# EAGLE design multi_sensor (EAGLE 6.5.0)
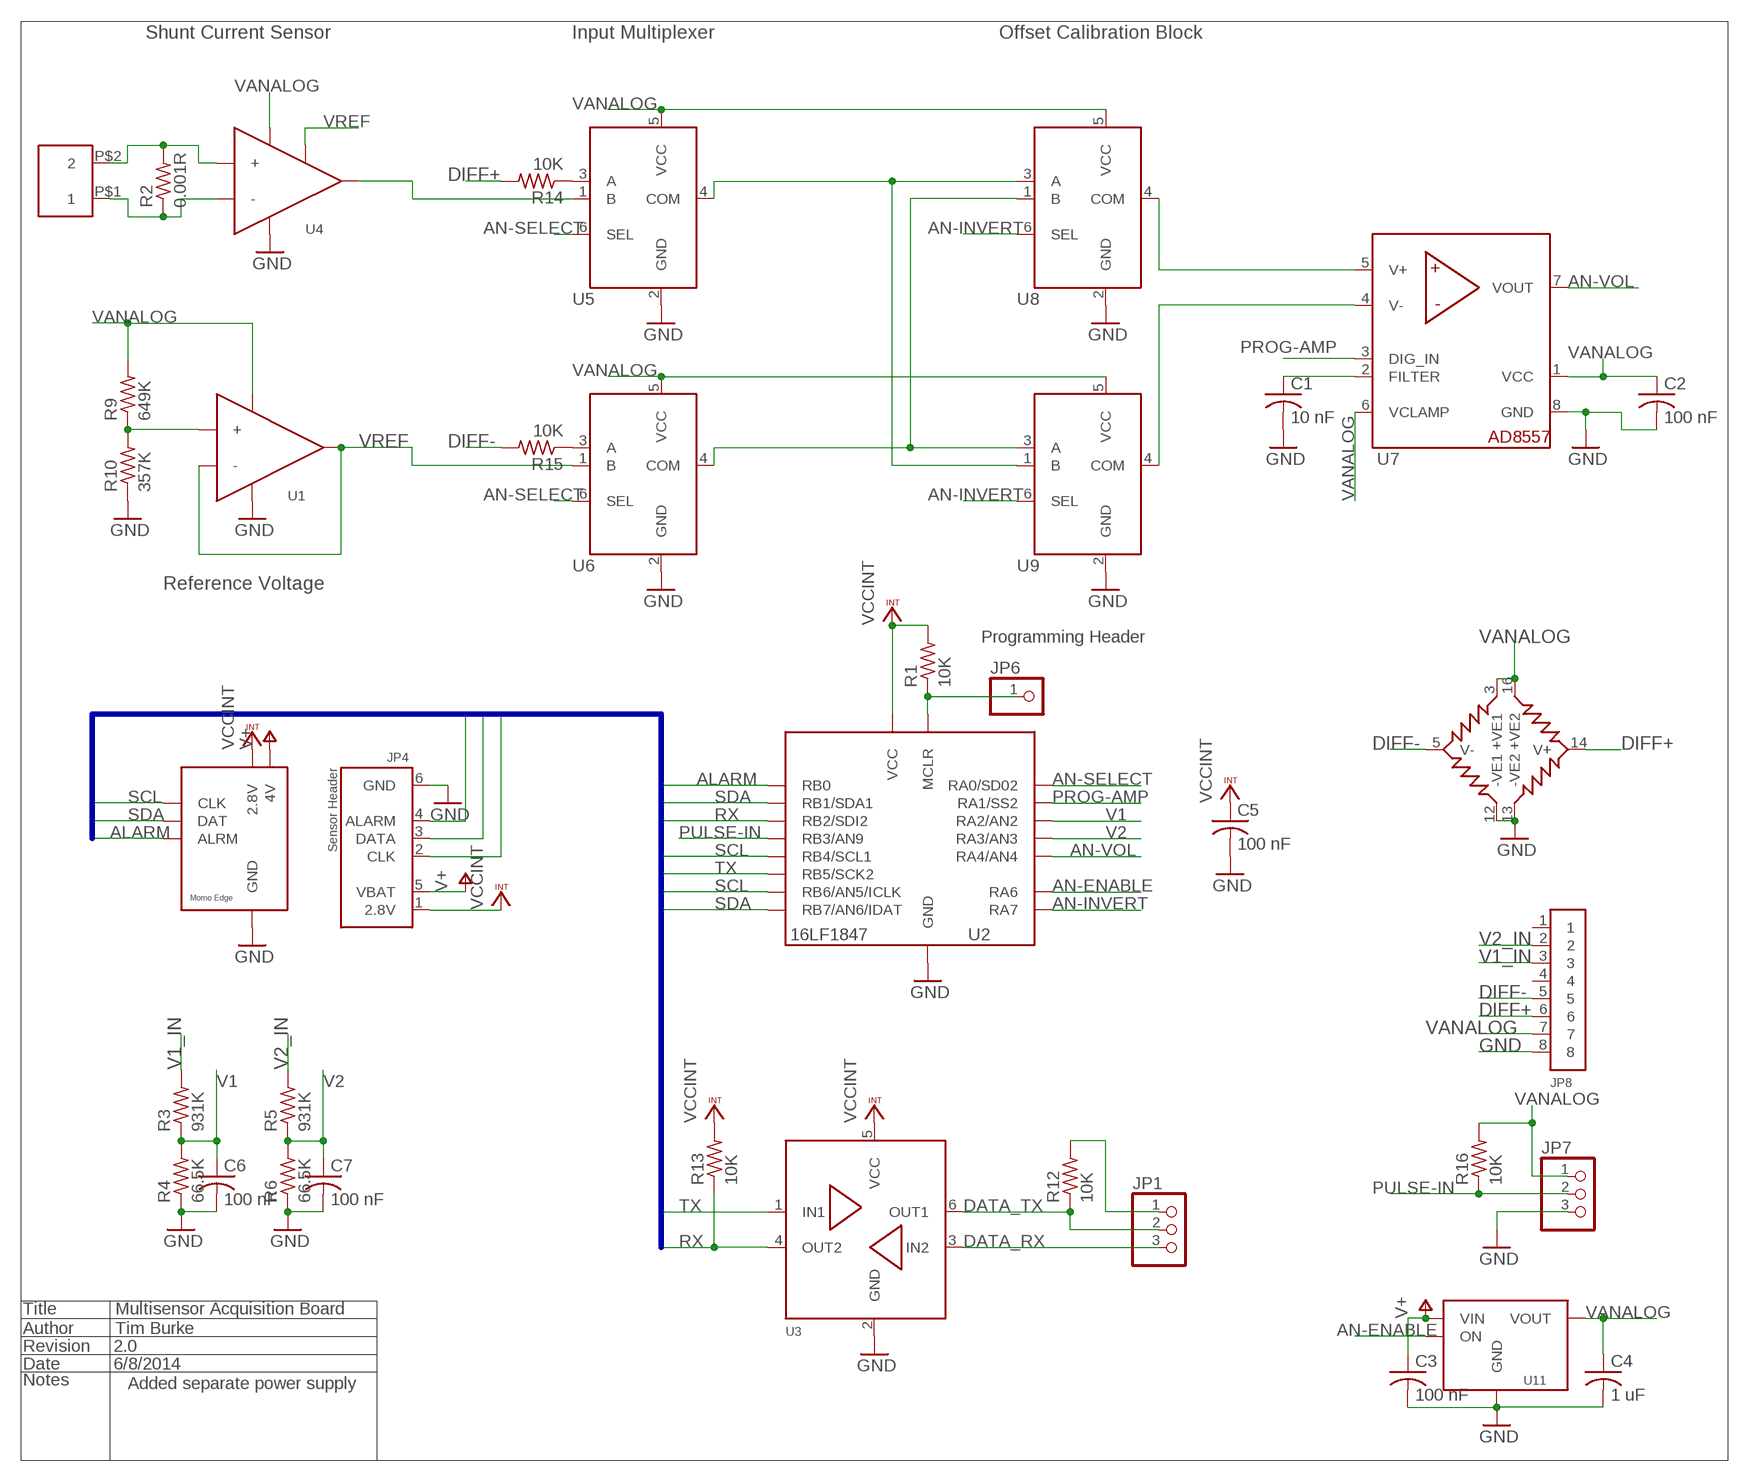
[diagram p0: schematic, sheet 1]

## Parts
C1  10 nF  C-USC0402  [C0402]
C2  100 nF  C-USC0402K  [C0402K]
C3  100 nF  C-USC0402K  [C0402K]
C4  1 uF  C-USC0402K  [C0402K]
C5  100 nF  C-USC0402K  [C0402K]
C6  100 nF  C-USC0402K  [C0402K]
C7  100 nF  C-USC0402K  [C0402K]
JP1  PINHD-1X3  [1X03]
JP2  MOMO-VERT-6M  [1X06]
JP3  5MM-SCREWTERM-2POS  [5MM-SCREWTERM]
JP4  MOMO-SENSOR-RJ11  [RJ-12]
JP6  PINHD-1X1  [1X01]
JP7  PINHD-1X3  [1X03]
JP8  8PIN-TERMBLOCK-PUSH  [8-PIN-TERMBLOCK-PUSH]
R1  10K  R-US_R0603  [R0603]
R2  0.001R  R-US_R2512  [R2512]
R3  931K  R-US_R0603  [R0603]
R4  66.5K  R-US_R0603  [R0603]
R5  931K  R-US_R0603  [R0603]
R6  66.5K  R-US_R0603  [R0603]
R9  649K  R-US_R0603  [R0603]
R10  357K  R-US_R0603  [R0603]
R12  10K  R-US_R0603  [R0603]
R13  10K  R-US_R0603  [R0603]
R14  10K  R-US_R0603  [R0603]
R15  10K  R-US_R0603  [R0603]
R16  10K  R-US_R0603  [R0603]
U1  MCP6001U  [SOT23-5L]
U2  16LF1847  [SSOP20]
U3  DUAL-BUFFER-OD-NC7WZ07  [SC70-6L]
U4  LT1990  [SOP08]
U5  2:1-MUX  [SOT363_INFINEON]
U6  2:1-MUX  [SOT363_INFINEON]
U7  AD8557-DIGITRIM-OPAMP  [SOIC8]
U8  2:1-MUX  [SOT363_INFINEON]
U9  2:1-MUX  [SOT363_INFINEON]
U10  SM5470-DIFF-PRESS-SENSOR  [SO16W]
U11  TCR2EF28-LINREG  [SC74A-5PIN]

## Nets
ALARM: JP2.5(ALRM) JP4.4(ALARM) U2.7(RB0)
AN-ENABLE: U2.17(RA6) U11.3(ON)
AN-INVERT: U2.18(RA7) U8.6(SEL) U9.6(SEL)
AN-SELECT: U2.19(RA0/SD02) U5.6(SEL) U6.6(SEL)
AN-VOL: U2.3(RA4/AN4) U7.7(VOUT)
DATA_RX: JP1.3 U3.3(IN2)
DATA_TX: JP1.2 R12.1 U3.6(OUT1)
DIFF+: JP8.6 R14.2 U10.14(V+)
DIFF-: JP8.5 R15.2 U10.5(V-)
GND: C1.2 C2.2 C3.2 C4.2 C5.2 C6.2 C7.2 JP2.7(GND) JP4.6(GND) JP7.3 JP8.8 R4.1 R6.1 R10.1 U1.2(GND) U2.5(GND) U2.6(GND) U3.2(GND) U4.4(GND) U5.2(GND) U6.2(GND) U7.8(GND) U8.2(GND) U9.2(GND) U10.12(-VE1) U10.13(-VE2) U11.2(GND)
N$2: JP1.1 R12.2
N$3: R9.1 R10.2 U1.1(+)
N$4: JP6.1 R1.1 U2.4(MCLR)
N$5: U5.4(COM) U8.3(A) U9.1(B)
N$6: R14.1 U5.3(A)
N$7: C1.1 U7.2(FILTER)
N$8: U6.4(COM) U8.1(B) U9.3(A)
N$9: R15.1 U6.3(A)
N$13: U7.5(V+) U8.4(COM)
N$14: U7.4(V-) U9.4(COM)
N$16: U4.6(OUT) U5.1(B)
PROG-AMP: U2.20(RA1/SS2) U7.3(DIG_IN)
PULSE-IN: JP7.2 R16.1 U2.10(RB3/AN9)
RS+: JP3.P$1 R2.1 U4.2(-)
RS-: JP3.P$2 R2.2 U4.3(+)
RX: R13.1 U2.9(RB2/SDI2) U3.4(OUT2)
SCL: JP2.3(CLK) JP4.2(CLK) U2.11(RB4/SCL1) U2.13(RB6/AN5/ICLK)
SDA: JP2.4(DAT) JP4.3(DATA) U2.8(RB1/SDA1) U2.14(RB7/AN6/IDAT)
TX: U2.12(RB5/SCK2) U3.1(IN1)
V1: C6.1 R3.1 R4.2 U2.1(RA2/AN2)
V1_IN: JP8.3 R3.2
V2: C7.1 R5.1 R6.2 U2.2(RA3/AN3)
V2_IN: JP8.2 R5.2
V+: C3.1 JP2.6(4V) JP4.5(VBAT) U11.1(VIN)
VANALOG: C2.1 C4.1 JP7.1 JP8.7 R9.2 R16.2 U1.5(VCC) U4.7(VCC) U5.5(VCC) U6.5(VCC) U7.1(VCC) U7.6(VCLAMP) U8.5(VCC) U9.5(VCC) U10.3(+VE1) U10.16(+VE2) U11.5(VOUT)
VCCINT: C5.1 JP2.1(2.8V) JP4.1(2.8V) R1.2 R13.2 U2.15(VCC) U2.16(VCC) U3.5(VCC)
VREF: U1.3(-) U1.4(OUT) U4.1(SHUT) U6.1(B)
Unconnected: JP8.1 JP8.4

## Buses
MIB:SDA,SCL,ALARM,TX,RX

## Notes on the sheet
- Shunt Current Sensor | Input Multiplexer | Offset Calibration Block
- Reference Voltage
- Programming Header
- Title | Multisensor Acquisition Board
- Author | Tim Burke
- Revision | 2.0
- Date | 6/8/2014
- Notes | Added separate power supply

## Library data of the parts
C1 = rcl:C-US: CAPACITOR, American symbol; DIGIKEY-PN: 490-6286-1-ND
C2 C3 C5-C7 = rcl:C-US: CAPACITOR, American symbol; DIGIKEY-PN: 445-1265-1-ND
C4 = rcl:C-US: CAPACITOR, American symbol; DIGIKEY-PN: 445-4114-1-ND
JP1 JP7 = pinhead:PINHD-1X3: PIN HEADER
JP2 = components:MOMO-VERT-6M; DIGIKEY-PN: S7004-ND
JP3 = components:5MM-SCREWTERM-2POS; DESCRIPTION: 2 position screw terminal; DIGIKEY-PN: 277-1667-ND; FOOTPRINT: Through Hole
JP4 = components:MOMO-SENSOR-RJ11; DIGIKEY-PN: AE10371-ND
JP6 = pinhead:PINHD-1X1: PIN HEADER
JP8 = components:8PIN-TERMBLOCK-PUSH; DESCRIPTION: 8-pin terminal block with push connectors; DIGIKEY-PN: 277-1628-ND; FOOTPRINT: Through Hole
R1 R12-R16 = rcl:R-US_: RESISTOR, American symbol; DIGIKEY-PN: P10.0KHCT-ND
R2 = rcl:R-US_: RESISTOR, American symbol; DIGIKEY-PN: CRF2512-FV-R001ELFCT-ND
R3 R5 = rcl:R-US_: RESISTOR, American symbol; DIGIKEY-PN: RHM931KCLCT-ND
R4 R6 = rcl:R-US_: RESISTOR, American symbol; DIGIKEY-PN: RC0603FR-0766K5L
R9 = rcl:R-US_: RESISTOR, American symbol; DIGIKEY-PN: 311-649KHRCT-ND
R10 = rcl:R-US_: RESISTOR, American symbol; DIGIKEY-PN: RC0603FR-07357KL
U1 = components:MCP6001U: MCP6001 General purpose op-amp in SOT23-5 package with U pin assignment; DESCRIPTION: MCP6001 General Purpose Op-Amp; DIGIKEY-PN: MCP6001UT-I/OTCT-ND; FOOTPRINT: SOT23-5
U2 = components:16LF1847; DIGIKEY-PN: PIC16LF1847-I/SS-ND
U3 = components:DUAL-BUFFER-OD-NC7WZ07: NC7WZ07 Dual Buffer with OD outputs and 5V tolerant inputs; DESCRIPTION: Dual open drain buffers; DIGIKEY-PN: NC7WZ07P6XCT-ND; FOOTPRINT: SO70-6
U4 = components:LT1990; DESCRIPTION: LT1990 High CM op amp; DIGIKEY-PN: LT1990CS8#PBF-ND; FOOTPRINT: SO-8
U5 U6 U8 U9 = components:2:1-MUX: 2:1 Analog Multiplexer -- low selects A, high B; DESCRIPTION: 2:1 Analog multiplexer; DIGIKEY-PN: 568-7765-1-ND; FOOTPRINT: SOT-363
U7 = components:AD8557-DIGITRIM-OPAMP: AD8557 Digitally controlled operational amplifier; DESCRIPTION: AD8557 Digitally controlled op-amp; DIGIKEY-PN: AD8557ARZ-ND; FOOTPRINT: SOIC-8
U10 = components:SM5470-DIFF-PRESS-SENSOR; DESCRIPTION: SM5470 Differential pressure sensor; FOOTPRINT: SO16-Wide; MANU: SI-Micro; MPN: SM5470; POPULATE: no
U11 = components:TCR2EF28-LINREG; DESCRIPTION: TCR2EF 2.8V Linear Regulator; DIGIKEY-PN: TCR2EF28LMCT-ND; FOOTPRINT: SC74A

## Board
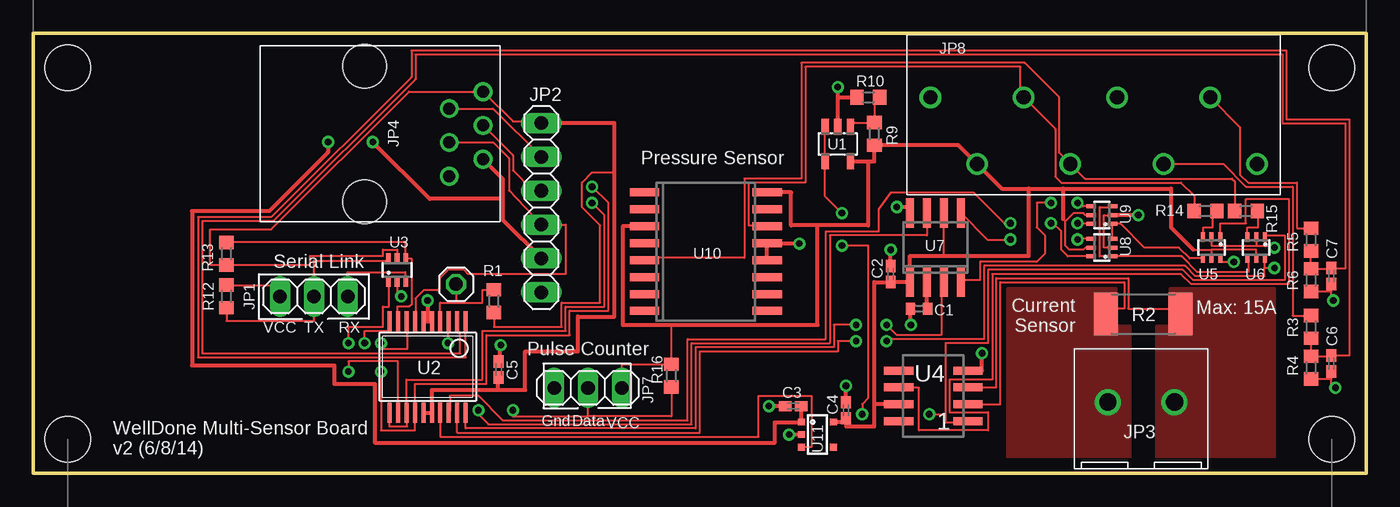
[diagram p1: board, top side]
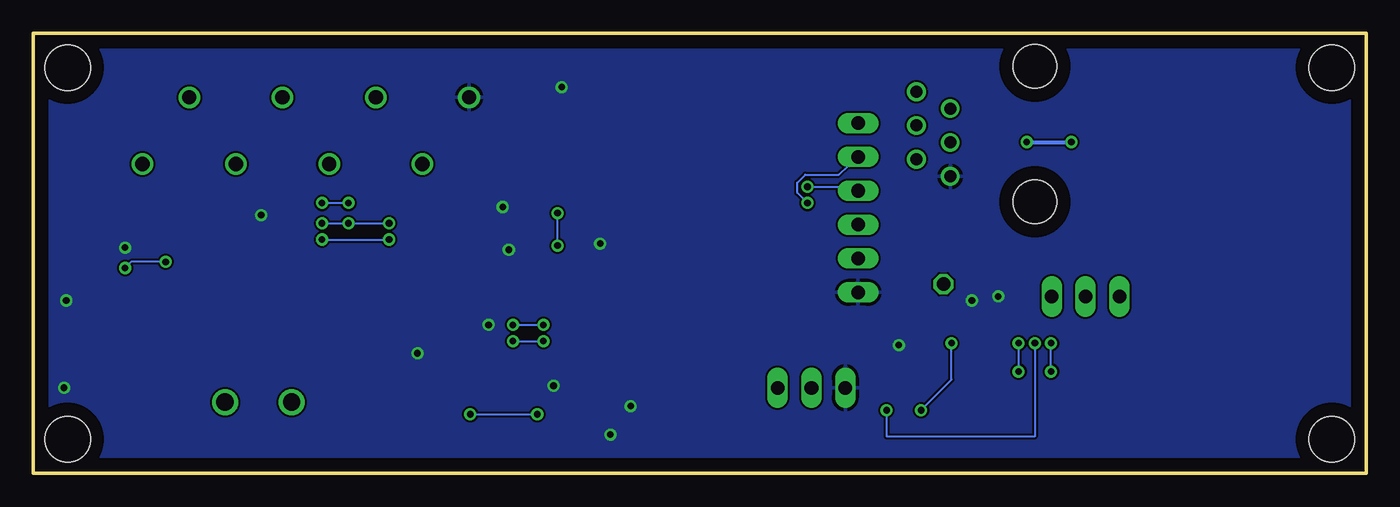
[diagram p2: board, bottom side, seen from below]

Size 100.03 x 33.02 mm. Coordinates in mm from the lower left corner, seen from the top.
Outline: 0,33.02 0,0 100.03,0 100.03,33.02 0,33.02
Copper layers (1*16): Top 0.035mm / dielectric 1.5mm / Bottom 0.035mm
Design rules "default *": minimum track width 6mil, minimum drill 19mil, track to track 6mil, track to pad 6mil, pad to pad 8mil, via to via 8mil, smd to smd 8mil, copper to edge 40mil, drill to drill 8mil, minimum pad ring 10mil, minimum via ring 8mil, stop-mask expansion 4mil, vias tented up to drill 0mil, thermal gap 10mil
Holes 3.43 mm at 2.57,2.57 2.57,30.45 97.46,30.45 97.46,2.57

### Footprints (pad centres in the part's own frame; a part is rotated, then mirrored left to right if it is on the bottom)
C0402 = smd 0.7 x 0.9: 1 -0.65,0; 2 0.65,0
C0402K = smd 0.925 x 0.74: 1 -0.6,0; 2 0.6,0
1X03 = drill 1.016 long: 1 -2.54,0; 2 0,0; 3 2.54,0
1X06 = drill 1.016 long: 1 -8.89,0; 3 -6.35,0; 4 -3.81,0; 5 -1.27,0; 6 1.27,0; 7 3.81,0
5MM-SCREWTERM = drill 1.3: P$1 -3,0; P$2 2,0
RJ-12 = drill 0.9: 1 -3.17,8.89; 2 -1.9,6.35; 3 -0.63,8.89; 4 0.64,6.35; 5 1.91,8.89; 6 3.18,6.35 | hole 3.28: -5.08,0; 5.08,0
1X01 = drill 1.016 octagon: 1 0,0
8-PIN-TERMBLOCK-PUSH = drill 1.076: 1 -15.75,5; 2 -12.25,0; 3 -8.75,5; 4 -5.25,0; 5 -1.75,5; 6 1.75,0; 7 5.25,5; 8 8.75,0
R0603 = smd 1 x 1.1: 1 -0.85,0; 2 0.85,0
R2512 = smd 1.8 x 3.2: 1 -2.8,0; 2 2.8,0
SOT23-5L = smd 0.55 x 1.2: 1 -0.95,-1.3; 2 0,-1.3; 3 0.95,-1.3; 4 0.95,1.3; 5 -0.95,1.3
SSOP20 = smd 0.3 x 1.5: 1 -2.857,-3.431; 2 -2.222,-3.431; 3 -1.587,-3.431; 4 -0.952,-3.431; 5 -0.317,-3.431; 6 0.318,-3.431; 7 0.953,-3.431; 8 1.588,-3.431; 9 2.223,-3.431; 10 2.858,-3.431; 11 2.858,3.431; 12 2.219,3.431; 13 1.588,3.431; 14 0.953,3.431; 15 0.318,3.431; 16 -0.317,3.431; 17 -0.952,3.431; 18 -1.587,3.431; 19 -2.222,3.431; 20 -2.857,3.431
SC70-6L = smd 0.35 x 0.8: 1 -0.65,-0.85; 2 0,-0.85; 3 0.65,-0.85; 4 0.65,0.85; 5 0,0.85; 6 -0.65,0.85
SOP08 = smd 0.6 x 2.2: 1 -1.905,-2.6; 2 -0.635,-2.6; 3 0.635,-2.6; 4 1.905,-2.6; 5 1.905,2.6; 6 0.635,2.6; 7 -0.635,2.6; 8 -1.905,2.6
SOT363_INFINEON = smd 0.3 x 0.7: 1 -0.65,-0.8; 2 0,-0.8; 3 0.65,-0.8; 4 0.65,0.8; 5 0,0.8; 6 -0.65,0.8
SOIC8 = smd 0.6 x 2.2: 1 -1.905,-2.6; 2 -0.635,-2.6; 3 0.635,-2.6; 4 1.905,-2.6; 5 1.905,2.6; 6 0.635,2.6; 7 -0.635,2.6; 8 -1.905,2.6
SO16W = smd 0.6 x 2.2: 1 -4.445,-4.6; 2 -3.175,-4.6; 3 -1.905,-4.6; 4 -0.635,-4.6; 5 0.635,-4.6; 6 1.905,-4.6; 7 3.175,-4.6; 8 4.445,-4.6; 9 4.445,4.6; 10 3.175,4.6; 11 1.905,4.6; 12 0.635,4.6; 13 -0.635,4.6; 14 -1.905,4.6; 15 -3.175,4.6; 16 -4.445,4.6
SC74A-5PIN = smd 0.5 x 0.5: 1 -0.95,-1.2; 2 0,-1.2; 3 0.95,-1.2; 4 0.95,1.2; 5 -0.95,1.2

### Placement (x,y rotation side)
C1  66.47,12.37 180 top
C2  64.34,14.96 90 top
C3  57.02,5.05 180 top
C4  60.99,4.75 90 top
C5  34.93,7.8 90 top
C6  97.41,8.25 270 top
C7  97.41,14.81 270 top
JP1  21.06,13.28 0 top
JP2  38.13,17.4 270 top
JP3  83.64,5.36 0 top
JP4  24.87,25.48 270 top
JP6  31.72,14.2 0 top
JP7  41.63,6.43 180 top
JP8  76.07,28.22 180 top
R1  34.57,12.93 270 top
R2  83.29,11.96 0 top
R3  95.89,11 90 top
R4  95.89,7.95 90 top
R5  95.89,17.55 90 top
R6  95.89,14.5 90 top
R9  63.12,25.48 270 top
R10  62.66,28.22 0 top
R12  14.5,13.28 90 top
R13  14.5,16.48 270 top
R14  87.96,19.68 180 top
R15  91.01,19.68 180 top
R16  47.88,7.34 90 top
U1  60.38,24.71 180 top
U2  29.59,8 180 top
U3  27.3,15.27 0 top
U4  67.54,5.82 90 top
U5  88.42,16.94 180 top
U6  91.77,16.94 180 top
U7  67.69,16.94 0 top
U8  80.19,16.94 90 top
U9  80.19,19.38 90 top
U10  50.47,16.64 270 top
U11  58.85,2.92 270 top

### Tracks (layer width: path | path; a pad name or v marks a point on that pad's centre or on a via)
ALARM
  Top 0.152: JP4.4 34.5,24.84 35.69,23.65 35.69,21.23 JP2.5 39.95,18.67 39.95,14.96 32.64,14.96 32.33,15.27 31.12,15.27 30.51,14.66 30.51,13.89 30.35,13.74 29.29,13.74 28.68,13.13 28.68,11.47 U2.7
AN-ENABLE
  Top 0.152: U2.17 30.54,2.77 54.43,2.77 54.43,5.82 58.39,5.82 58.39,1.97 U11.3
AN-INVERT  (via drill 0.5)
  Top 0.152: U8.6 77.64,16.29 77.14,16.79 77.14,18.16 76.53,18.77 v76.38,18.77 | U9.6 78.4,18.73 v78.36,18.77 | v73.33,18.77 72.87,18.77 70.59,21.06 64.34,21.06 63.42,19.84 63.42,18.16 59.46,18.16 59.46,10.08 49.1,10.08 49.1,3.99 35.23,3.99 33.4,5.82 31.27,5.82 31.27,4.66 U2.18
  Bottom 0.152: v78.36,18.77 v76.38,18.77 v73.33,18.77
AN-SELECT  (via drill 0.5)
  Top 0.152: U6.6 92.38,16.14 92.38,15.42 | 89.07,15.88 U5.6 89.03,16.14 89.03,15.88 89.07,15.88 | 92.38,15.42 92.38,14.81 87.2,14.81 86.44,15.57 71.35,15.57 71.35,10.08 64.19,10.08 v64.03,9.93 | 92.38,15.42 v93.14,15.42 | 89.07,15.88 v90.09,15.88 | v61.75,9.93 60.38,9.93 60.38,9.17 50.01,9.17 50.01,3.07 31.81,3.07 U2.19
  Bottom 0.152: v90.09,15.88 92.68,15.88 v93.14,15.42 | v64.03,9.93 v61.75,9.93
AN-VOL  (via drill 0.5)
  Top 0.152: U7.7 67.06,17.86 59.77,17.86 59.77,9.78 49.4,9.78 49.4,3.68 34.16,3.68 33.4,4.45 v33.4,4.75 | v31.12,9.78 31.12,11.43 U2.3
  Bottom 0.152: v33.4,4.75 31.12,7.04 v31.12,9.78
DATA_RX
  Top 0.152: JP1.3 23.6,15.11 27.91,15.11 27.91,14.26 U3.3
DATA_TX
  Top 0.152: R12.1 14.5,11.46 21.06,11.46 JP1.2 21.06,15.96 26.5,15.96 U3.6
DIFF+
  Top 0.152: R14.2 87.11,20.84 86.13,21.82 77.14,21.82 76.68,22.28 76.68,25.86 JP8.6 74.09,28.45 74.09,30.51 57.94,30.51 57.94,21.82 53.67,21.82 53.67,18.62 55.07,18.62 U10.14
DIFF-
  Top 0.152: R15.2 90.16,21.91 89.94,22.12 78.92,22.12 JP8.5 76.99,24.06 76.99,28.22 74.4,30.81 57.63,30.81 57.63,22.12 53.37,22.12 53.37,16.18 45.87,16.18 U10.5
GND  (via drill 0.5)
  Top 0.152: v97.71,6.43 97.41,6.43 97.41,7.1 | 97.41,7.1 C6.2 | v97.56,12.98 97.41,12.98 97.41,13.65 | 97.41,13.65 C7.2 | R6.1 97.41,13.65 | R4.1 97.41,7.1 | U5.2 88.42,17.09 91.77,17.09 | U6.2 91.77,17.09 | 91.77,17.09 92.68,17.09 v93.14,16.94 | U8.2 80.34,16.94 80.34,19.38 U9.2 | U3.2 27.31,13.44 v27.61,13.28
  Top 0.305: U4.4 71.2,7.72 v71.2,9.02 | v82.93,19.38 U9.2 | U1.2 60.38,28.22 | 60.38,28.22 R10.1 | U7.8 65.79,19.99 v64.8,19.99 | C2.2 v64.34,16.79 | v65.86,11.15 65.82,11.15 C1.2 | 60.38,28.22 v60.38,28.98 | U10.12 U10.13 55.07,17.25 v57.48,17.25 | C5.2 35.03,8.41 35.03,9.63 v35.08,9.63 | U2.6 U2.5 29.59,11.43 v29.59,12.98 | C3.2 v55.19,5.05 | U11.2 v56.72,2.92 | C4.2 v60.99,6.58
  pour Bottom: -0.58,33.55 -0.58,-0.74 101.22,-0.74 101.22,33.55
N$2
  Top 0.152: R12.2 18.52,14.13 JP1.1
N$3
  Top 0.152: U1.1 61.64,26.33 R9.1 63.12,27.76 63.42,28.07 63.42,28.13 R10.2
N$4
  Top 0.152: U2.4 30.54,12.83 31.72,12.83 | 31.72,12.83 33.71,12.83 33.71,13.78 R1.1 | JP6.1 31.72,12.83
N$5
  Top 0.152: U5.4 86.78,16.14 85.98,16.94 83.39,16.94 81.6,18.73 U9.1 U8.3
N$6
  Top 0.152: U5.3 87.81,17.74 87.81,18.47 88.51,18.47 88.51,19.69 R14.1
N$7
  Top 0.152: 67.08,14.34 U7.2
  Top 0.305: C1.1 67.06,12.37 U7.2
N$8
  Top 0.152: U6.4 91.16,16.14 91.16,15.11 87.35,15.11 86.17,16.29 U8.1 80.04,16.29 80.04,19.99 80.99,19.99 U9.3
N$9
  Top 0.152: U6.3 91.12,18.47 91.92,18.47 91.92,19.69 R15.1
N$13  (via drill 0.5)
  Top 0.152: U8.4 78.4,17.59 v78.36,17.55 | U7.5 71.59,17.55 v73.33,17.55
  Bottom 0.152: v78.36,17.55 v73.33,17.55
N$14  (via drill 0.5)
  Top 0.152: U9.4 78.78,20.03 v78.36,20.29 | v76.38,20.29 75.31,20.29 75.31,18.47 75.92,17.86 75.92,16.48 75.31,15.88 71.04,15.88 71.04,14.5 69.6,14.5 U7.4
  Bottom 0.152: v78.36,20.29 v76.38,20.29
N$16
  Top 0.152: U5.1 89.07,18.77 91.01,18.77 91.01,20.6 94.21,20.6 94.21,14.2 86.89,14.2 86.13,14.96 71.96,14.96 71.96,7.04 68.76,7.04 68.76,4.6 71.65,4.6 71.65,3.23 66.47,3.23 66.47,6.43 64.94,6.43 U4.6
PROG-AMP  (via drill 0.5)
  Top 0.152: U7.3 68.15,14.34 68.15,10.39 64.8,10.39 v64.03,11.15 | v61.75,11.15 60.07,11.15 60.07,9.47 49.71,9.47 49.71,3.38 32.45,3.38 U2.20
  Bottom 0.152: v64.03,11.15 v61.75,11.15
PULSE-IN  (via drill 0.5)
  Top 0.152: v35.99,4.75 35.99,4.29 41.63,4.29 | 41.63,4.29 JP7.2 | R16.1 47.88,4.29 41.63,4.29 | v24.87,9.78 24.87,10.69 26.7,10.69 26.7,11.43 U2.10
  Bottom 0.152: v35.99,4.75 35.99,2.77 24.87,2.77 v24.87,9.78
RS+
  Top 0.152: U4.2 72.57,5.18 72.57,14.35 81.86,14.35 81.86,12.37 80.49,12.37 R2.1
  pour Top (no thermals): 82.27,11.05 82.27,0.89 73.13,0.89 73.13,13.84 81.25,13.84 81.25,11.05
RS-
  Top 0.152: U4.3 72.26,6.45 72.26,14.66 82.17,14.66 82.17,12.37 86.09,12.37 R2.2
  pour Top (no thermals): 84.3,0.89 93.14,0.89 93.14,13.84 85.32,13.84 85.32,11.05 84.3,11.05
RX
  Top 0.152: R13.1 27.96,17.33 U3.4 28.37,16.12 28.37,12.67 28.22,12.52 27.31,12.52 27.31,11.5 U2.9
SCL  (via drill 0.5)
  Top 0.152: JP4.2 34.5,27.38 JP2.3 | 26.7,4.57 U2.11 26.73,3.53 28.07,3.53 28.07,4.51 U2.13 28,7.04 33.71,7.04 33.71,10.69 39.95,10.69 39.95,12.52 42.85,12.52 42.85,19.38 v41.94,20.29
  Bottom 0.152: v41.94,20.29 42.7,21.06 42.7,21.82 42.09,22.43 39.57,22.43 JP2.3
SDA  (via drill 0.5)
  Top 0.152: v41.94,21.51 43.15,20.29 43.15,12.22 40.26,12.22 40.26,10.39 34.01,10.39 34.01,6.73 28.64,6.73 U2.14 28.64,3.23 26.09,3.23 v26.09,7.65 | 38.15,21.36 JP2.4 37.39,21.34 35.99,22.73 35.99,23.87 JP4.3 | U2.8 28.07,11.43 28.07,9.32 26.09,9.32 v26.09,9.78
  Bottom 0.152: v41.94,21.51 38.3,21.51 JP2.4 | v26.09,9.78 v26.09,7.65
TX  (via drill 0.5)
  Top 0.152: 26.7,14.22 U3.1 26.7,14.42 26.7,12.52 26.24,12.52 26.24,11 23.65,11 v23.65,9.78 | U2.12 27.37,8.41 23.65,8.41 v23.65,7.65
  Bottom 0.152: v23.65,7.65 v23.65,9.78
V1
  Top 0.152: R3.1 R4.2 97.41,8.8 C6.1 98.78,8.86 98.78,26.54 94.06,26.54 94.06,31.72 28.37,31.72 28.37,29.74 17.86,19.23 12.37,19.23 12.37,8.71 32.45,8.71 U2.1
  Top 0.254: 97.31,8.8 C6.1
V1_IN
  Top 0.152: JP8.3 89.3,23.22 91.01,21.51 94.51,21.51 94.51,11.85 R3.2
V2
  Top 0.152: R5.1 R6.2 97.41,15.35 C7.1 98.48,15.41 98.48,26.24 93.75,26.24 93.75,31.42 28.68,31.42 28.68,29.59 18.01,18.92 12.67,18.92 12.67,9.02 32.03,9.02 32.03,10.54 31.88,10.54 31.88,11.43 U2.2
V2_IN
  Top 0.152: JP8.2 90.55,25.99 90.55,22.43 91.16,21.82 94.82,21.82 94.82,18.4 R5.2
V+  (via drill 0.5)
  Top 0.305: 35.23,20.6 35.23,19.02 JP2.6 | 35.23,20.6 35.23,22.09 JP4.5 | 35.23,20.6 29.74,20.6 v25.48,24.87 | v22.12,24.87 22.12,24.1 17.7,19.69 11.91,19.69 11.91,8.1 22.58,8.1 22.58,6.73 25.63,6.73 25.63,2.31 55.65,2.31 55.65,3.84 57.65,3.84 U11.1 57.65,5.05 C3.1
  Bottom 0.305: v25.48,24.87 v22.12,24.87
VANALOG
  Top 0.152: U6.5 91.77,16.79 88.42,16.79 | 88.42,16.79 U5.5 | 87.05,16.79 88.42,16.79 | U9.5 78.97,19.38 78.82,19.53 78.05,19.53 77.44,18.92 | U8.5 78.97,16.94 78.82,16.79 77.75,16.79 77.44,17.09 77.44,18.92 | 77.44,18.92 77.29,19.08 | 48.18,11.15 47.88,11.15 R16.2 44.17,8.19 JP7.1 | U7.6 68.3,19.54 68.3,16.33
  Top 0.305: 74.7,21.36 72.68,21.36 JP8.7 69.42,24.63 R9.2 63.12,23.41 62.66,23.41 | 74.7,21.36 77.29,21.36 | 77.29,21.36 85.37,21.36 85.37,18.47 87.05,16.79 | 77.29,19.08 77.29,21.36 | 74.7,21.36 74.7,16.33 68.3,16.33 65.79,16.33 U7.1 65.79,14.36 C2.1 64.34,14.35 63.12,14.35 63.12,5.18 | U4.7 63.12,5.18 | 63.12,5.18 63.12,3.53 60.99,3.53 C4.1 60.99,3.87 U11.5 | U1.5 62.66,23.41 | 58.85,18.62 62.66,18.62 62.66,23.41 | 58.85,18.62 56.87,18.62 56.87,21.08 U10.16 | U10.3 44.22,18.54 44.22,11.15 48.18,11.15 58.85,11.15 58.85,18.62
VCCINT
  Top 0.152: R1.2 34.57,11 39.65,11 39.65,12.83 42.55,12.83 42.55,18.62 41.17,19.99 41.17,21.82 41.94,22.58 43.61,22.58 | U3.5 27.31,16.79 26.24,16.79 26.24,16.33 20.75,16.33 20.75,15.63 R13.2 13.28,15.63 13.28,18.31 17.86,18.31 28.19,28.65 JP4.1 | 33.73,28.68 JP4.1 | JP4.1 35.99,26.42 38,26.42 JP2.1
  Top 0.305: U2.15 U2.16 29.91,6.27 34.87,6.27 | 34.87,6.27 36.91,6.27 36.91,9.17 40.87,9.17 40.87,11.76 43.61,11.76 43.61,22.58 43.61,26.29 JP2.1 | 34.87,6.27 34.87,7.2 C5.1
VREF  (via drill 0.5)
  Top 0.152: U6.1 92.42,17.86 93.9,17.86 93.9,14.5 87.05,14.5 86.28,15.27 71.65,15.27 71.65,9.78 68.45,9.78 68.45,4.45 | U1.3 U1.4 59.43,20.79 v60.68,19.53 | 68.45,4.45 68.45,3.84 70.14,3.84 U4.1 | v67.23,4.45 68.45,4.45 | v62.2,4.45 62.2,5.21 62.66,5.66 62.66,17.09 v60.68,17.09
  Bottom 0.152: v67.23,4.45 v62.2,4.45 62.2,4.6 | v60.68,17.09 v60.68,19.53

### Text on the board
tPlace: Pressure Sensor | Serial Link | Current / Sensor | Max: 15A | VCC | TX | RX | Pulse Counter | Gnd | Data | VCC | WellDone Multi-Sensor Board / v2 (6/8/14)